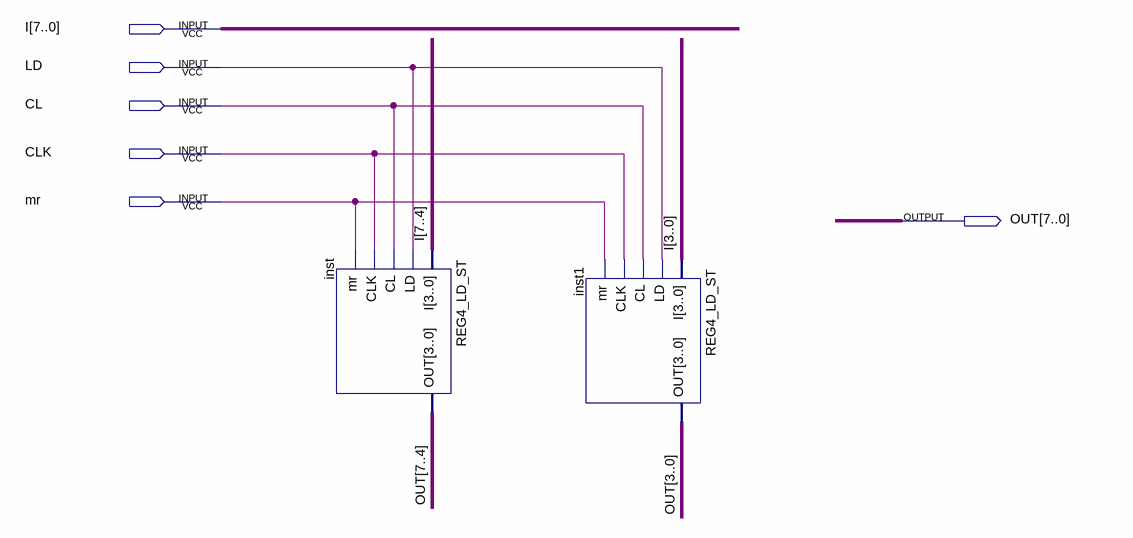
[diagram p0: schematic sheet]
// Quartus schematic REG8_LD_ST.bdf as structural Verilog: 2 symbols, 6 pins
module REG8_LD_ST (
  input  [7:0] I,
  input  LD,
  input  CL,
  input  CLK,
  input  mr,
  output [7:0] OUT
);

  REG4_LD_ST inst (.I(I[7:4]), .LD(LD), .CL(CL), .CLK(CLK), .mr(mr), .OUT(OUT[7:4]));
  REG4_LD_ST inst1 (.I(I[3:0]), .LD(LD), .CL(CL), .CLK(CLK), .mr(mr), .OUT(OUT[3:0]));
endmodule
